# EAGLE schematic BIM_V2 (EAGLE 9.1.3)

## Sheet 1 of 7
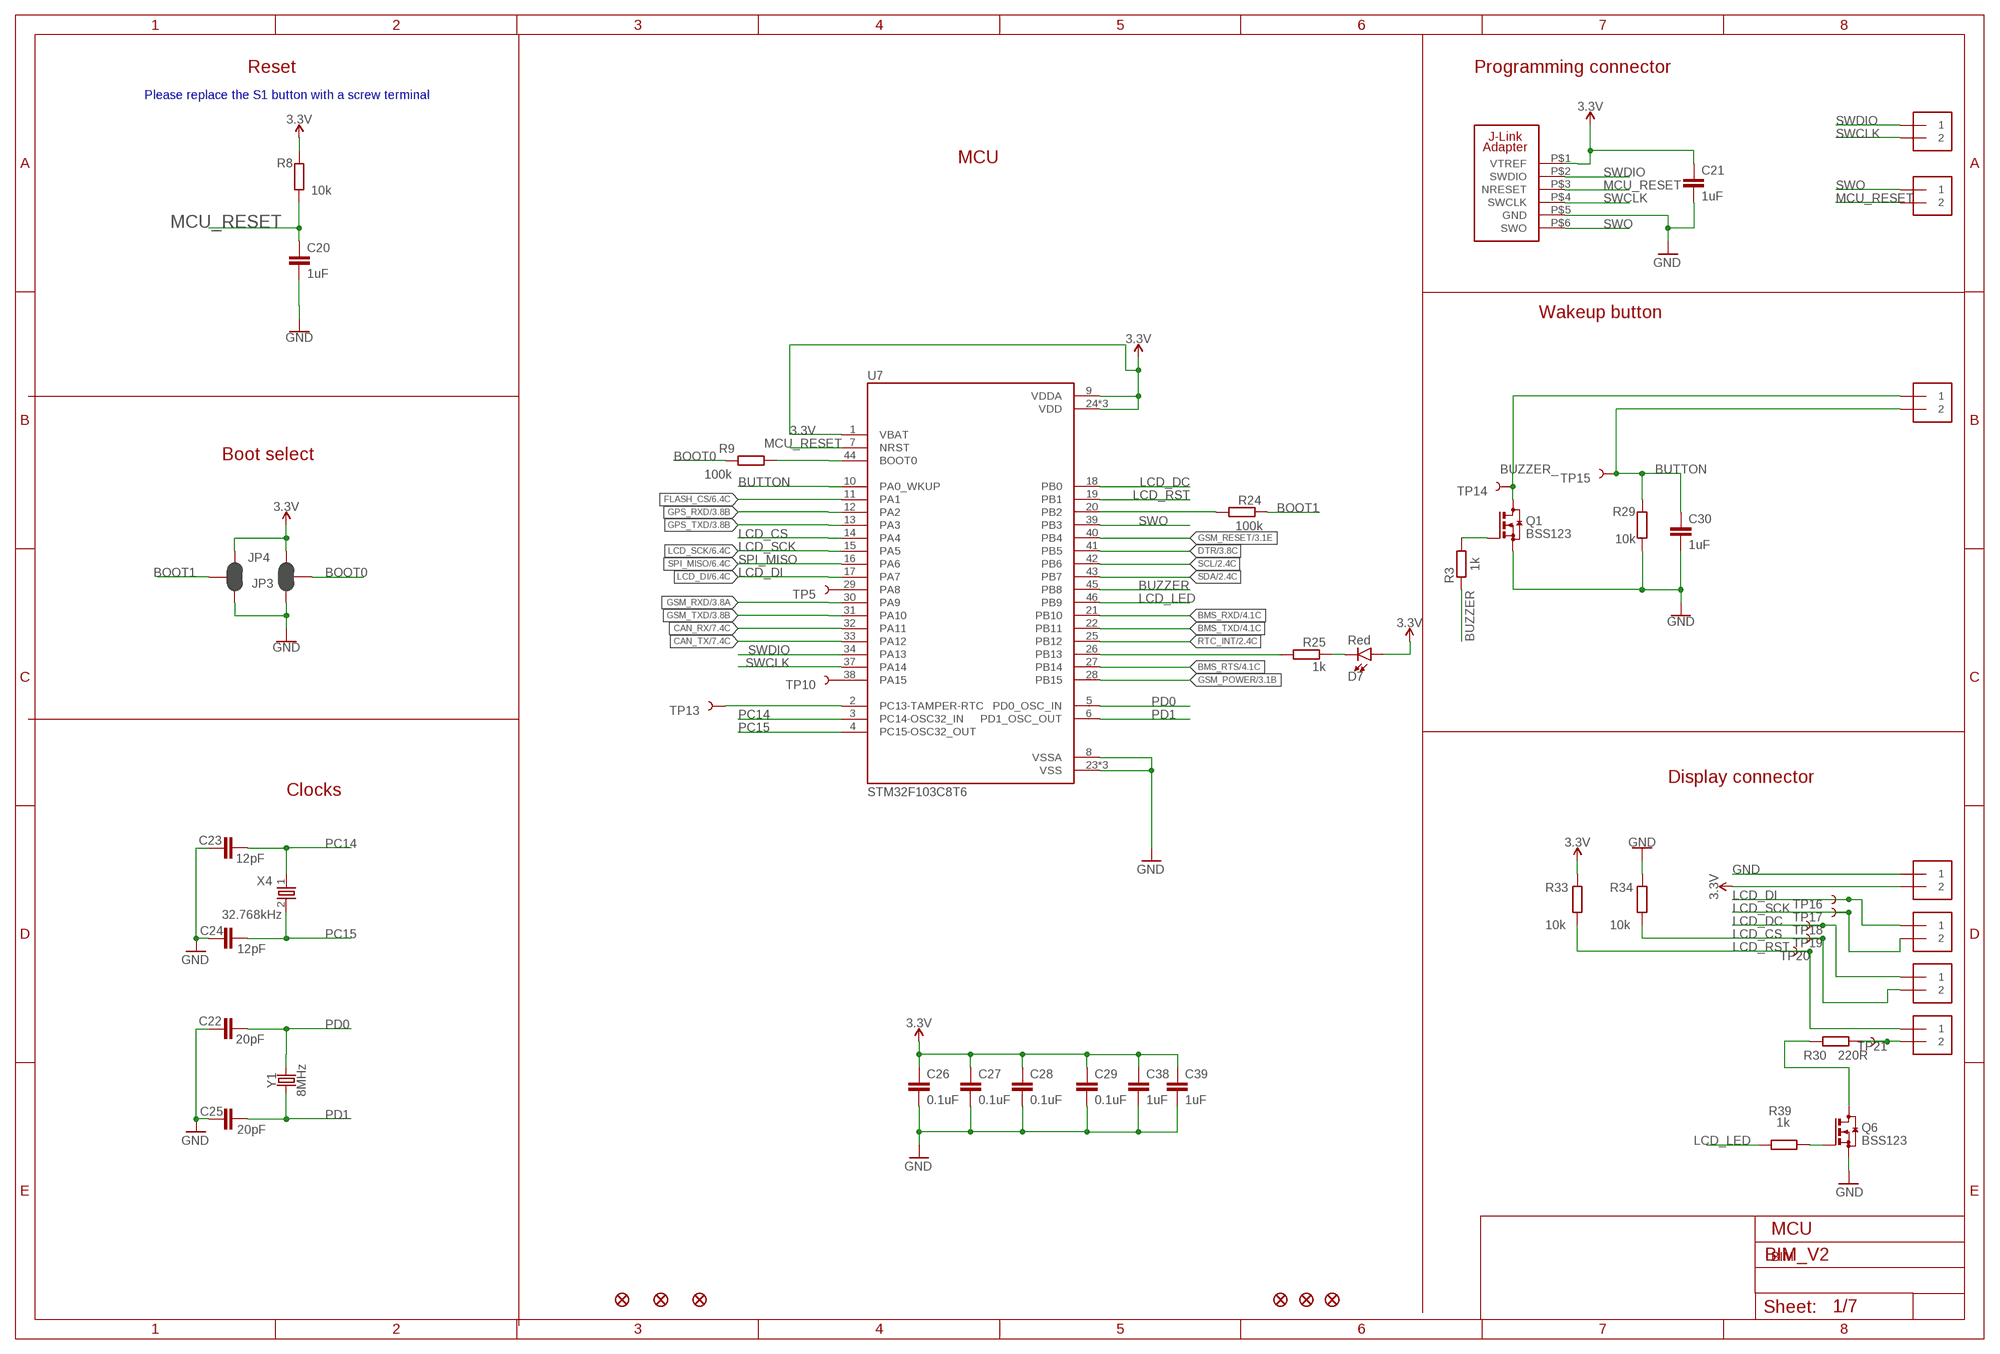
[diagram p0: schematic, sheet 1]

### Parts
C20  1uF  C-EUC0402  [C0402]
C21  1uF  C-EUC0402  [C0402]
C22  20pF  C-EUC0402  [C0402]
C23  12pF  C-EUC0402  [C0402]
C24  12pF  C-EUC0402  [C0402]
C25  20pF  C-EUC0402  [C0402]
C26  0.1uF  C-EUC0402  [C0402]
C27  0.1uF  C-EUC0402  [C0402]
C28  0.1uF  C-EUC0402  [C0402]
C29  0.1uF  C-EUC0402  [C0402]
C30  1uF  C-EUC0402  [C0402]
C38  1uF  C-EUC0402  [C0402]
C39  1uF  C-EUC0402  [C0402]
D7  Red  LED0603  [LED-0603]
FD1  FIDUCIAL1X2  [FIDUCIAL-1X2]
FD2  FIDUCIAL1X2  [FIDUCIAL-1X2]
FD3  FIDUCIAL1X2  [FIDUCIAL-1X2]
FD4  FIDUCIAL1X2  [FIDUCIAL-1X2]
FD5  FIDUCIAL1X2  [FIDUCIAL-1X2]
FD6  FIDUCIAL1X2  [FIDUCIAL-1X2]
JP3  JUMPER-SMT_3_2-NC_PASTE_SILK  [SMT-JUMPER_3_2-NC_PASTE_SILK]
JP4  JUMPER-SMT_3_2-NC_PASTE_SILK  [SMT-JUMPER_3_2-NC_PASTE_SILK]
Q1  BSS123  [SOT23]
Q6  BSS123  [SOT23]
R3  1k  R-EU_R0402  [R0402]
R8  10k  R-EU_R0402  [R0402]
R9  100k  R-EU_R0402  [R0402]
R24  100k  R-EU_R0402  [R0402]
R25  1k  R-EU_R0402  [R0402]
R29  10k  R-EU_R0402  [R0402]
R30  220R  R-EU_R0402  [R0402]
R33  10k  R-EU_R0402  [R0402]
R34  10k  R-EU_R0402  [R0402]
R39  1k  R-EU_R0402  [R0402]
S2  1X2-3.5MM  [1X2-3.5MM]
S3  1X2-3.5MM  [1X2-3.5MM]
S4  1X2-3.5MM  [1X2-3.5MM]
TP5  TEST-POINT3X4  [PAD.03X.04]
TP10  TEST-POINT3X4  [PAD.03X.04]
TP13  TEST-POINT3X4  [PAD.03X.04]
TP14  TEST-POINT3X4  [PAD.03X.04]
TP15  TEST-POINT3X4  [PAD.03X.04]
TP16  TEST-POINT3X4  [PAD.03X.04]
TP17  TEST-POINT3X4  [PAD.03X.04]
TP18  TEST-POINT3X4  [PAD.03X.04]
TP19  TEST-POINT3X4  [PAD.03X.04]
TP20  TEST-POINT3X4  [PAD.03X.04]
TP21  TEST-POINT3X4  [PAD.03X.04]
U7  STM32F103C8T6  [QFP50P900X900X160-48N]
U$1  J-LINK_6-PIN_ADAPTER-1  [J-LINK_6-PIN_ADAPTER_S]
X3-1  1X2-3.5MM  [1X2-3.5MM]
X3-2  1X2-3.5MM  [1X2-3.5MM]
X3-3  1X2-3.5MM  [1X2-3.5MM]
X3-4  1X2-3.5MM  [1X2-3.5MM]
X4  32.768kHz  XTAL_32KHZ  [XTAL_3215_N]
Y1  8MHz  CRYSTAL-8MHZSMD-5X3.2  [CRYSTAL-SMD-5X3.2-4PAD]

### Nets
3.3V: C21.1 C26.1 C27.1 C28.1 C29.1 C38.1 C39.1 D7.A JP3.3 JP4.3 R8.2 R33.1 U7.1(VBAT) U7.9(VDDA) U7.24(VDD) U7.36(VDD) U7.48(VDD) U$1.P$1(VTREF) X3-1.2 ; also sheet 2,3,4,5,6,7
BMS_RTS: U7.27(PB14) ; also sheet 4,7
BMS_RXD: U7.21(PB10) ; also sheet 4
BMS_TXD: U7.22(PB11) ; also sheet 4
BOOT0: JP3.2 R9.2
BOOT1: JP4.2 R24.2
BUTTON: C30.1 R29.2 S2.2 TP15.P$1 U7.10(PA0_WKUP)
BUZZER: R3.2 U7.45(PB8)
BUZZER_: Q1.3(D) S2.1 TP14.P$1
CAN_RX: U7.32(PA11) ; also sheet 7
CAN_TX: U7.33(PA12) ; also sheet 7
DTR: U7.41(PB5) ; also sheet 3
FLASH_CS: U7.11(PA1) ; also sheet 6
GND: C20.2 C21.2 C22.1 C23.1 C24.1 C25.1 C26.2 C27.2 C28.2 C29.2 C30.2 C38.2 C39.2 JP3.1 JP4.1 Q1.2(S) Q6.2(S) R29.1 R34.1 U7.8(VSSA) U7.23(VSS) U7.35(VSS) U7.47(VSS) U$1.P$5(GND) X3-1.1 ; also sheet 2,3,4,5,6,7
GPS_RXD: U7.12(PA2) ; also sheet 3
GPS_TXD: U7.13(PA3) ; also sheet 3
GSM_POWER: U7.28(PB15) ; also sheet 3
GSM_RESET: U7.40(PB4) ; also sheet 3
GSM_RXD: U7.30(PA9) ; also sheet 3
GSM_TXD: U7.31(PA10) ; also sheet 3
LCD_CS: R34.2 TP19.P$1 U7.14(PA4) X3-3.2
LCD_DC: TP18.P$1 U7.18(PB0) X3-3.1
LCD_DI: TP16.P$1 U7.17(PA7) X3-2.1 ; also sheet 6
LCD_LED: R39.2 U7.46(PB9)
LCD_RST: R33.2 TP20.P$1 U7.19(PB1) X3-4.1
LCD_SCK: TP17.P$1 U7.15(PA5) X3-2.2 ; also sheet 6
MCU_RESET: C20.1 R8.1 S4.2 U7.7(NRST) U$1.P$3(NRESET)
N$2: TP5.P$1 U7.29(PA8)
N$4: Q1.1(G) R3.1
N$7: TP13.P$1 U7.2(PC13-TAMPER-RTC)
N$8: TP10.P$1 U7.38(PA15)
N$9: D7.C R25.1
N$12: R25.2 U7.26(PB13)
N$19: R9.1 U7.44(BOOT0)
N$20: R24.1 U7.20(PB2)
N$23: Q6.3(D) R30.2
N$24: R30.1 TP21.P$1 X3-4.2
N$25: Q6.1(G) R39.1
PC14: C23.2 U7.3(PC14-OSC32_IN) X4.1
PC15: C24.2 U7.4(PC15-OSC32_OUT) X4.2
PD0: C22.2 U7.5(PD0_OSC_IN) Y1.3
PD1: C25.2 U7.6(PD1_OSC_OUT) Y1.1
RTC_INT: U7.25(PB12) ; also sheet 2
SCL: U7.42(PB6) ; also sheet 2
SDA: U7.43(PB7) ; also sheet 2
SPI_MISO: U7.16(PA6) ; also sheet 6
SWCLK: S3.2 U7.37(PA14) U$1.P$4(SWCLK)
SWDIO: S3.1 U7.34(PA13) U$1.P$2(SWDIO)
SWO: S4.1 U7.39(PB3) U$1.P$6(SWO)

### Notes on the sheet
- Reset | Programming connector
- Please replace the S1 button with a screw terminal
- MCU
- Wakeup button
- Boot select
- Display connector
- Clocks
- MCU
- BIM

## Sheet 2 of 7
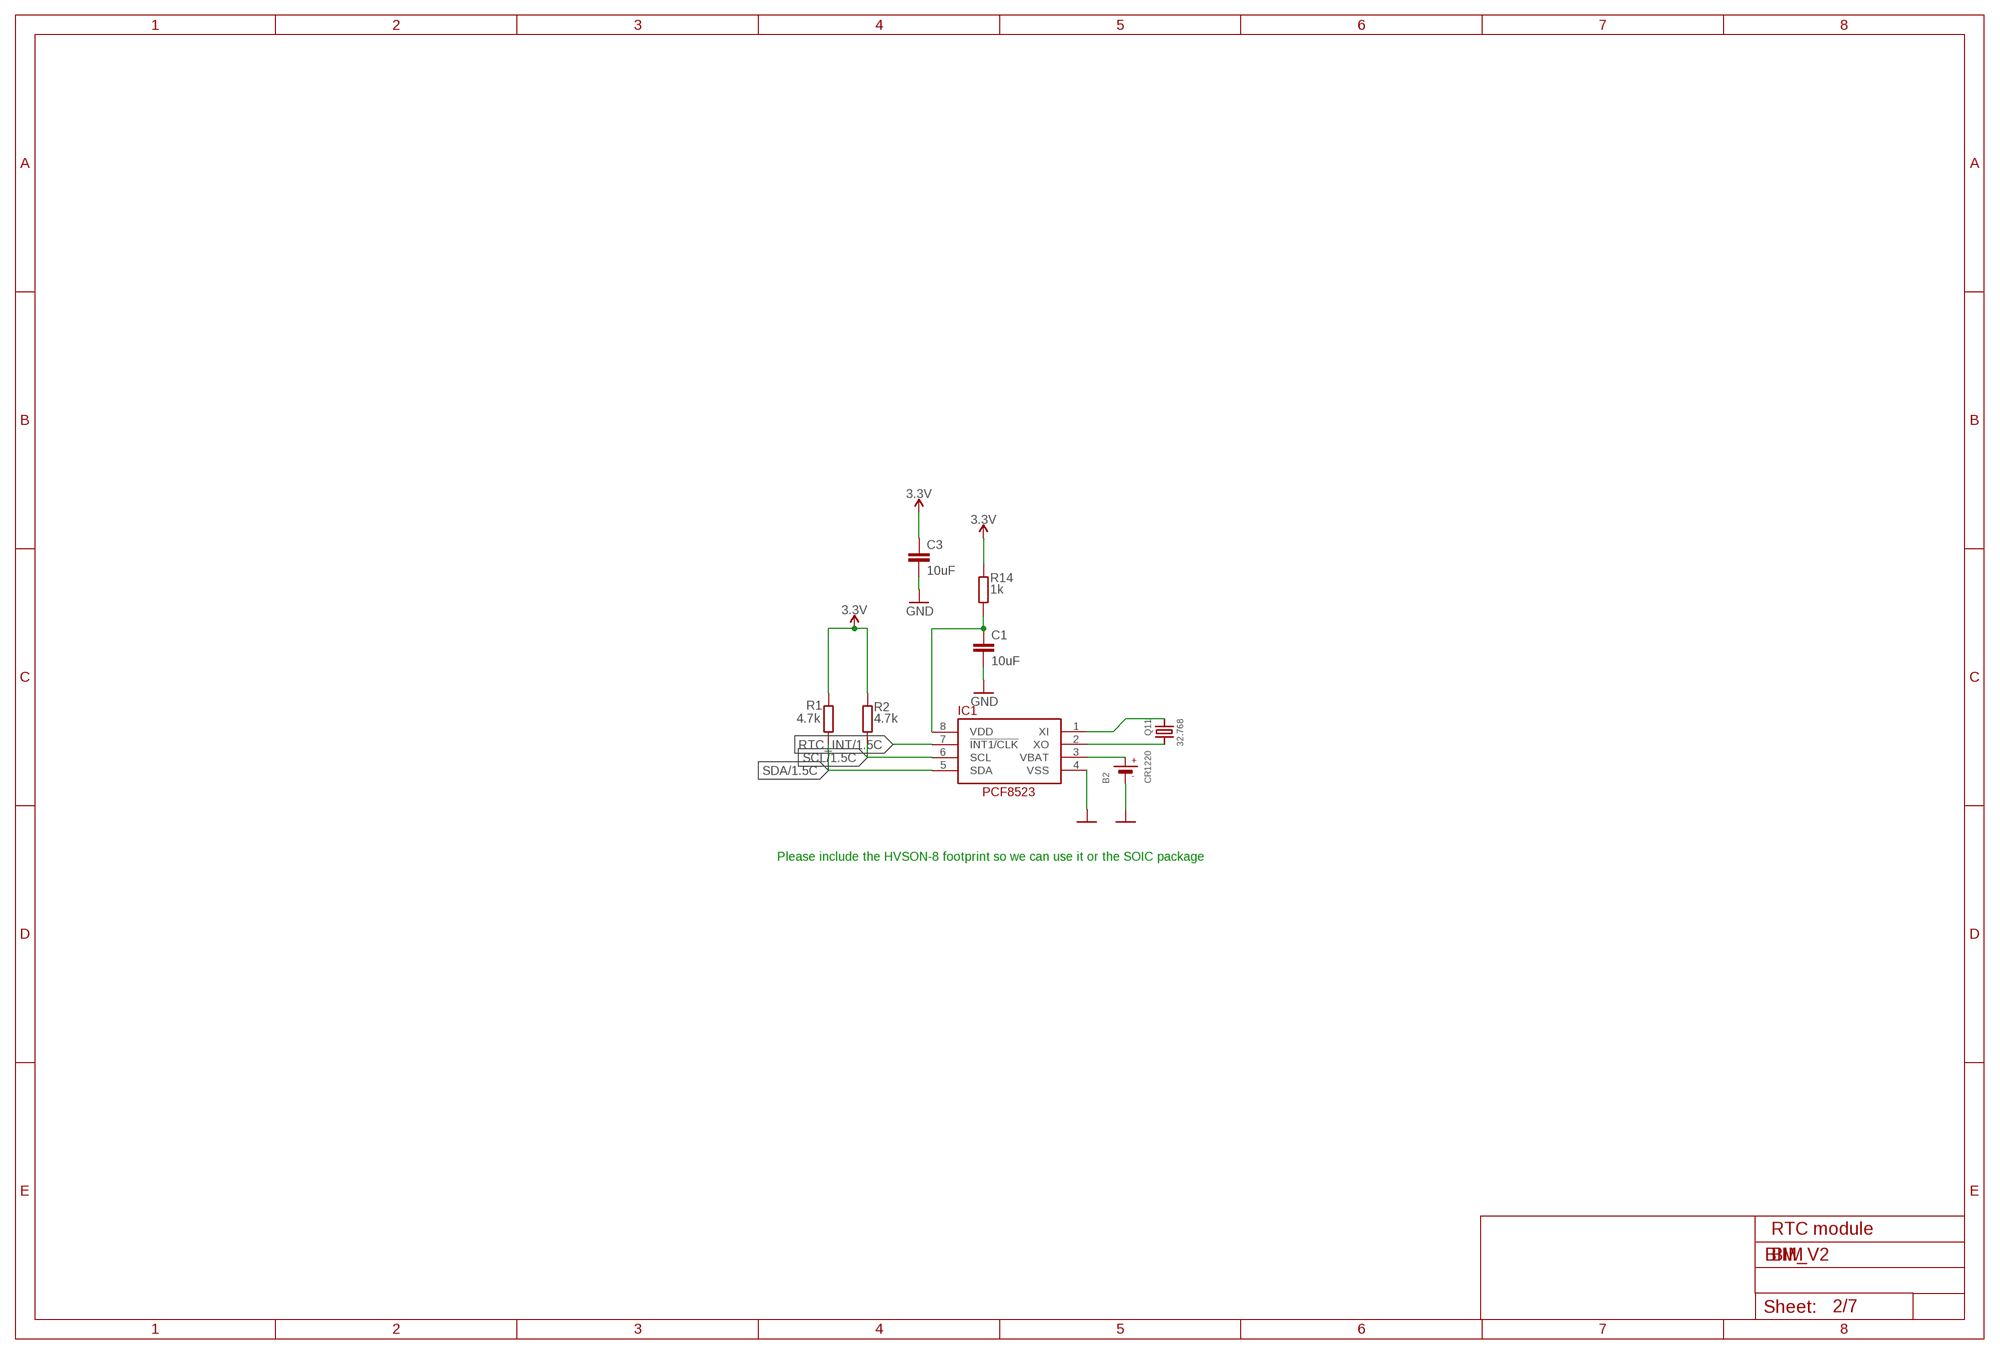
[diagram p1: schematic, sheet 2]

### Parts
B2  CR1220  BATTERYCR1220_SMT  [CR1220]
C1  10uF  C-EUC0402  [C0402]
C3  10uF  C-EUC0402  [C0402]
IC1  RTC_PCF8523T  [SOIC8_150MIL]
Q11  32.768  CRYSTAL8.0X3.8  [CRYSTAL_8X3.8]
R1  4.7k  R-EU_R0402  [R0402]
R2  4.7k  R-EU_R0402  [R0402]
R14  1k  R-EU_R0402  [R0402]

### Nets
3.3V: C3.1 R1.1 R2.1 R14.1 ; also sheet 1,3,4,5,6,7
GND: B2.- C1.2 C3.2 IC1.4(VSS) ; also sheet 1,3,4,5,6,7
N$6: IC1.1(XI) Q11.P$1
N$15: IC1.2(XO) Q11.P$4
N$17: C1.1 IC1.8(VDD) R14.2
RTC_INT: IC1.7(!INT1/CLK) ; also sheet 1
SCL: IC1.6(SCL) R2.2 ; also sheet 1
SDA: IC1.5(SDA) R1.2 ; also sheet 1
VBAT1: B2.+$1(+) IC1.3(VBAT)

### Notes on the sheet
- Please include the HVSON-8 footprint so we can use it or the SOIC package
- RTC module
- BIM

## Sheet 3 of 7
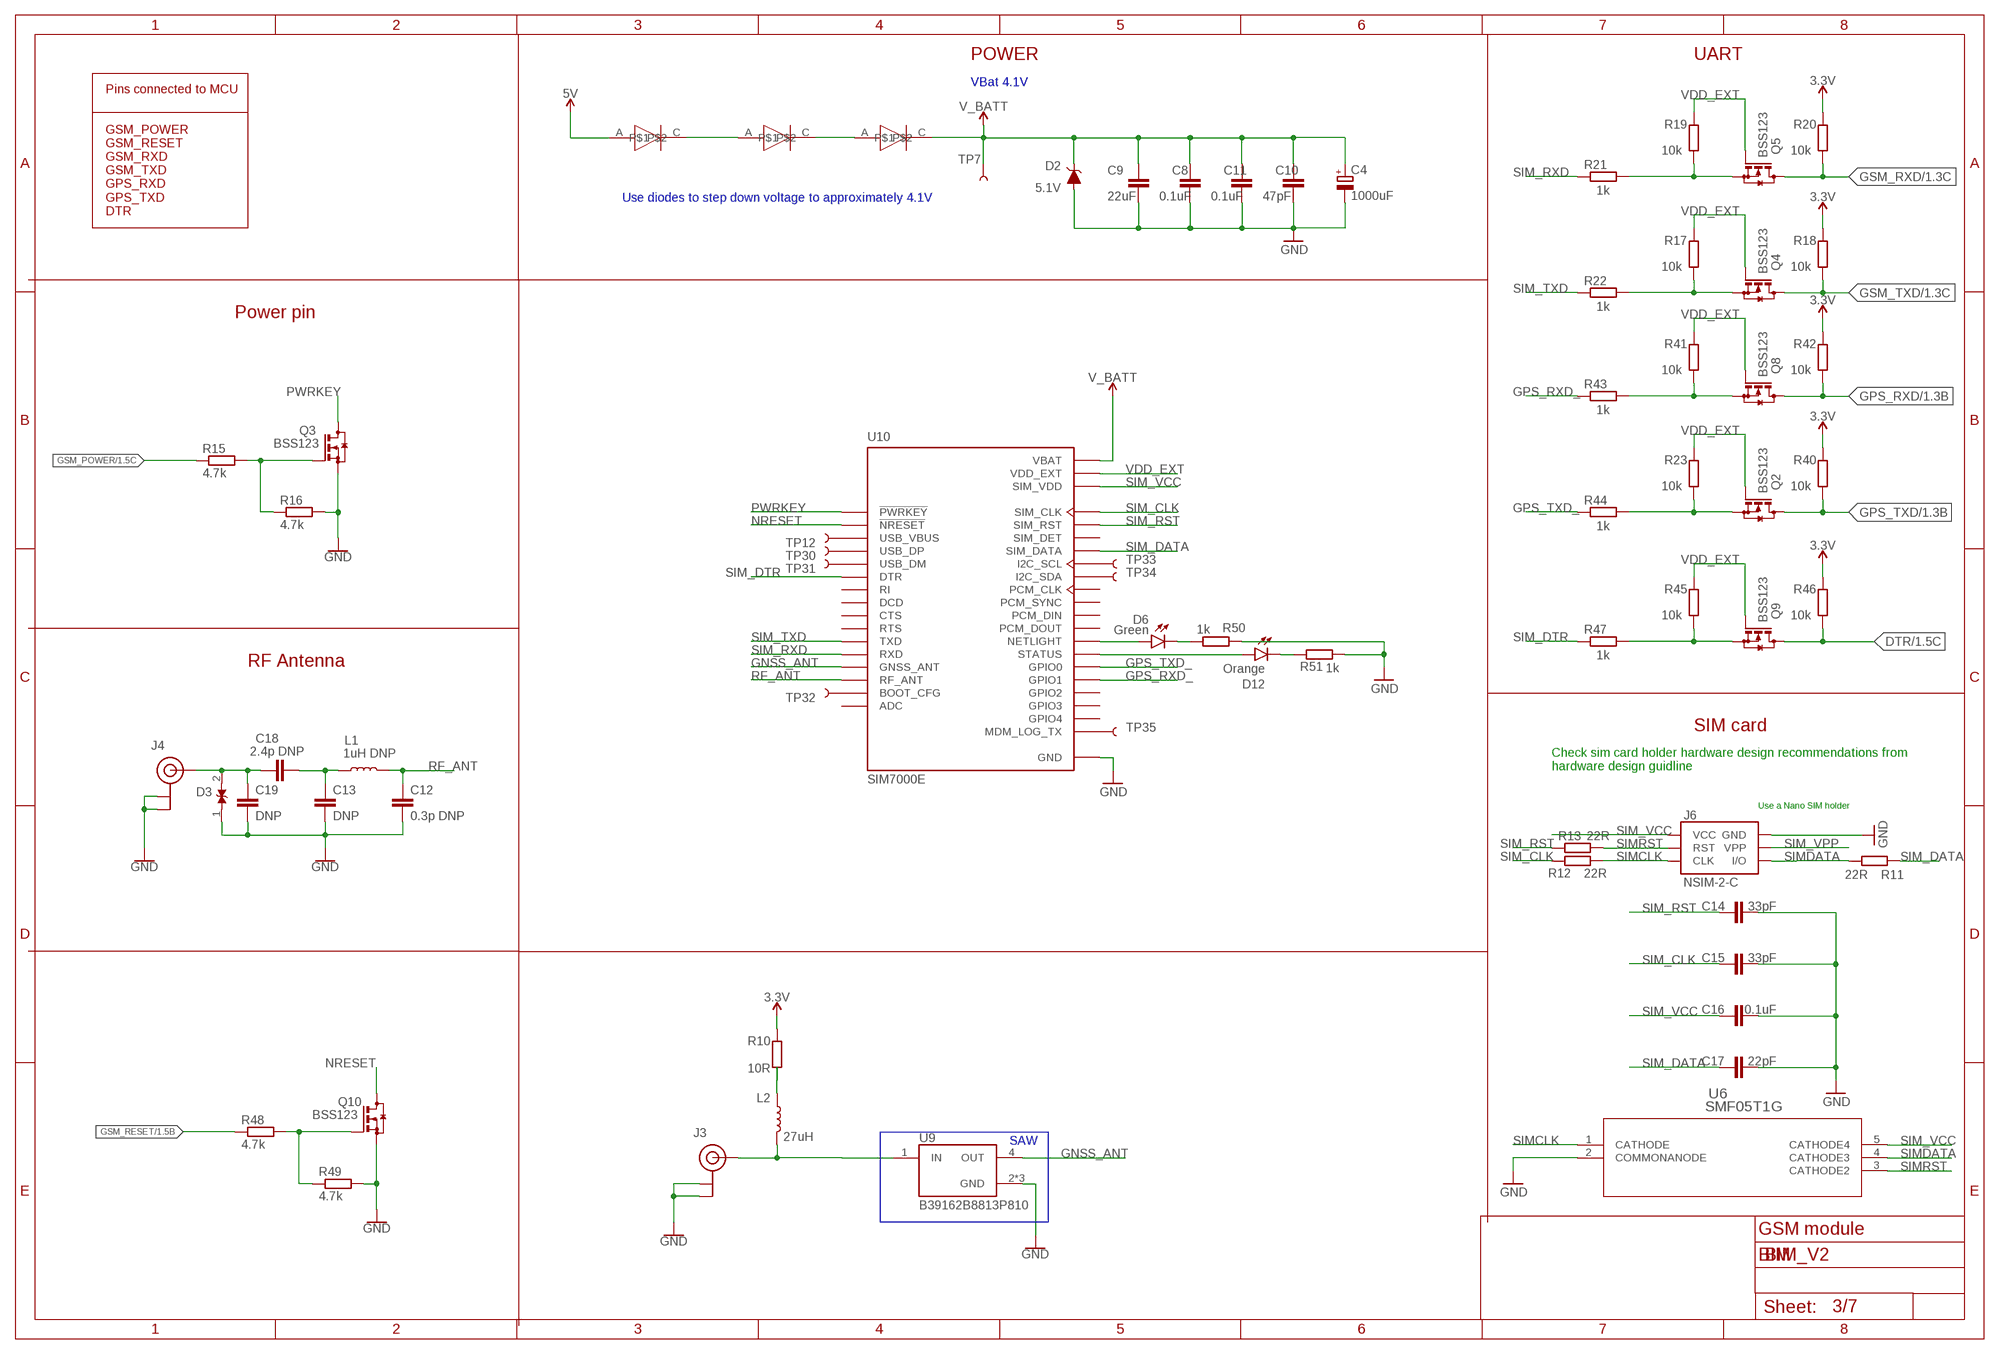
[diagram p2: schematic, sheet 3]

### Parts
C4  1000uF  CPOL-EUD/7343-31R  [D/7343-31R]
C8  0.1uF  C-EUC0402  [C0402]
C9  22uF  C-EUC0805  [C0805]
C10  47pF  C-EUC0402  [C0402]
C11  0.1uF  C-EUC0402  [C0402]
C12  0.3p DNP  C-EUC0402  [C0402]
C13  DNP  C-EUC0402  [C0402]
C14  33pF  C-EUC0402  [C0402]
C15  33pF  C-EUC0402  [C0402]
C16  0.1uF  C-EUC0402  [C0402]
C17  22pF  C-EUC0402  [C0402]
C18  2.4p DNP  C-EUC0402  [C0402]
C19  DNP  C-EUC0402  [C0402]
D2  5.1V  DIODE-ZENER-BZT52C3V6S  [SOD-323]
D3  D5V0L1B2LP4-7B  [DIODFN100X60X40-2N]
D6  Green  LED0603  [LED-0603]
D12  Orange  LED0603  [LED-0603]
J3  U.FL  [U.FL]
J4  U.FL  [U.FL]
J6  NSIM-2-C  SIMHOLDERSIM  [SIMHOLDER]
L1  1uH DNP  INDUCTOR-0603-33NH  [0603]
L2  27uH  INDUCTOR-0603-33NH  [0603]
Q2  BSS123  [SOT23]
Q3  BSS123  [SOT23]
Q4  BSS123  [SOT23]
Q5  BSS123  [SOT23]
Q8  BSS123  [SOT23]
Q9  BSS123  [SOT23]
Q10  BSS123  [SOT23]
R10  10R  R-EU_R0402  [R0402]
R11  22R  R-EU_R0402  [R0402]
R12  22R  R-EU_R0402  [R0402]
R13  22R  R-EU_R0402  [R0402]
R15  4.7k  R-EU_R0402  [R0402]
R16  4.7k  R-EU_R0402  [R0402]
R17  10k  R-EU_R0402  [R0402]
R18  10k  R-EU_R0402  [R0402]
R19  10k  R-EU_R0402  [R0402]
R20  10k  R-EU_R0402  [R0402]
R21  1k  R-EU_R0402  [R0402]
R22  1k  R-EU_R0402  [R0402]
R23  10k  R-EU_R0402  [R0402]
R40  10k  R-EU_R0402  [R0402]
R41  10k  R-EU_R0402  [R0402]
R42  10k  R-EU_R0402  [R0402]
R43  1k  R-EU_R0402  [R0402]
R44  1k  R-EU_R0402  [R0402]
R45  10k  R-EU_R0402  [R0402]
R46  10k  R-EU_R0402  [R0402]
R47  1k  R-EU_R0402  [R0402]
R48  4.7k  R-EU_R0402  [R0402]
R49  4.7k  R-EU_R0402  [R0402]
R50  1k  R-EU_R0402  [R0402]
R51  1k  R-EU_R0402  [R0402]
TP7  TEST-POINT3X4  [PAD.03X.04]
TP12  TEST-POINT3X4  [PAD.03X.04]
TP30  TEST-POINT3X4  [PAD.03X.04]
TP31  TEST-POINT3X4  [PAD.03X.04]
TP32  TEST-POINT3X4  [PAD.03X.04]
TP33  TEST-POINT3X4  [PAD.03X.04]
TP34  TEST-POINT3X4  [PAD.03X.04]
TP35  TEST-POINT3X4  [PAD.03X.04]
U6  SMF05T1G  [SC-88A-5_1P35X2P2_ONS]
U9  B39162B8813P810  [FIL_B39162B9417K610]
U10  SIM7000E  [SIMCON_SIM7000E]
U$2  0ohm 2010 resistor  HS3FB  [DIOM5436X261N]
U$3  0ohm 2010 resistor  HS3FB  [DIOM5436X261N]
U$4  HS3FB  [DIOM5436X261N]

### Nets
3.3V: R10.2 R18.2 R20.2 R40.2 R42.2 R46.2 ; also sheet 1,2,4,5,6,7
5V [INPUT]: U$2.A ; also sheet 5,7
DTR: Q9.3(D) R46.1 ; also sheet 1
GND: C4.- C8.2 C9.2 C10.2 C11.2 C12.2 C13.2 C14.2 C15.2 C16.2 C17.2 C19.2 D2.A D3.1 J3.1(GND) J3.2(GND) J4.1(GND) J4.2(GND) J6.C5(GND) Q3.2(S) Q10.2(S) R16.2 R49.2 R50.2 R51.2 U6.2(COMMONANODE) U9.2(GND) U9.3(GND) U9.5(GND) U10.2(GND) U10.17(GND) U10.18(GND) U10.29(GND) U10.39(GND) U10.45(GND) U10.46(GND) U10.54(GND) U10.58(GND) U10.59(GND) U10.61(GND) U10.62(GND) U10.63(GND) U10.64(GND) U10.65(GND) ; also sheet 1,2,4,5,6,7
GNSS_ANT: U9.4(OUT) U10.53(GNSS_ANT)
GPS_RXD: Q8.3(D) R42.1 ; also sheet 1
GPS_RXD_: R43.2 U10.49(GPIO1)
GPS_TXD: Q2.3(D) R40.1 ; also sheet 1
GPS_TXD_: R44.2 U10.50(GPIO0)
GSM_POWER: R15.1 ; also sheet 1
GSM_RESET: R48.1 ; also sheet 1
GSM_RXD: Q5.3(D) R20.1 ; also sheet 1
GSM_TXD: Q4.3(D) R18.1 ; also sheet 1
N$3: Q10.1(G) R48.2 R49.1
N$16: Q3.1(G) R15.2 R16.1
N$22: U$3.C U$4.A
N$30: U$2.C U$3.A
N$37: C13.1 C18.2 L1.1
N$38: J3.FEED(SIGNAL) L2.2 U9.1(IN)
N$39: TP33.P$1 U10.38(I2C_SCL)
N$40: L2.1 R10.1
N$41: TP12.P$1 U10.24(USB_VBUS)
N$42: TP30.P$1 U10.27(USB_DP)
N$43: TP31.P$1 U10.28(USB_DM)
N$44: TP34.P$1 U10.37(I2C_SDA)
N$45: D6.C R50.1
N$46: D6.A U10.52(NETLIGHT)
N$47: D12.C R51.1
N$48: D12.A U10.66(STATUS)
N$49: TP32.P$1 U10.6(BOOT_CFG)
N$50: TP35.P$1 U10.23(MDM_LOG_TX)
NRESET: Q10.3(D) U10.16(!NRESET)
PWRKEY: Q3.3(D) U10.1(!PWRKEY)
RF_ANT: C12.1 C18.1 C19.1 D3.2 J4.FEED(SIGNAL) L1.2 U10.60(RF_ANT)
SIM_CLK: C15.1 R12.1 U10.32(SIM_CLK)
SIM_DATA: C17.1 R11.1 U10.31(SIM_DATA)
SIM_DTR: R47.2 U10.3(DTR)
SIM_RST: C14.1 R13.1 U10.33(SIM_RST)
SIM_RXD: R21.2 U10.10(RXD)
SIM_TXD: R22.2 U10.9(TXD)
SIM_VCC: C16.1 J6.C1(VCC) U6.5(CATHODE4) U10.30(SIM_VDD)
SIM_VPP: J6.C6(VPP)
SIMCLK: J6.C3(CLK) R12.2 U6.1(CATHODE)
SIMDATA: J6.C7(I/O) R11.2 U6.4(CATHODE3)
SIMRST: J6.C2(RST) R13.2 U6.3(CATHODE2)
SIMRXD: Q5.2(S) R19.1 R21.1
SIMRXD1: Q8.2(S) R41.1 R43.1
SIMTXD: Q4.2(S) R17.1 R22.1
SIMTXD1: Q2.2(S) R23.1 R44.1
SIMTXD2: Q9.2(S) R45.1 R47.1
V_BATT: C4.+ C8.1 C9.1 C10.1 C11.1 D2.C TP7.P$1 U10.55(VBAT) U10.56(VBAT) U10.57(VBAT) U$4.C
VDD_EXT: Q2.1(G) Q4.1(G) Q5.1(G) Q8.1(G) Q9.1(G) R17.2 R19.2 R23.2 R41.2 R45.2 U10.15(VDD_EXT)
Unconnected: U10.4(RI) U10.5(DCD) U10.7(CTS) U10.8(RTS) U10.11(PCM_CLK) U10.12(PCM_SYNC) U10.13(PCM_DIN) U10.14(PCM_DOUT) U10.25(ADC) U10.34(SIM_DET) U10.48(GPIO4) U10.67(GPIO2) U10.68(GPIO3)

### Buses
B$2

### Notes on the sheet
- POWER | UART
- VBat 4.1V
- Pins connected to MCU
  
  
  GSM_POWER
  GSM_RESET
  GSM_RXD
  GSM_TXD
  GPS_RXD
  GPS_TXD
  DTR
- Use diodes to step down voltage to approximately 4.1V
- Power pin
- RF Antenna
- SIM card
- Check sim card holder hardware design recommendations from 
  hardware design guidline
- Use a Nano SIM holder
- SAW
- GSM module
- BIM

## Sheet 4 of 7
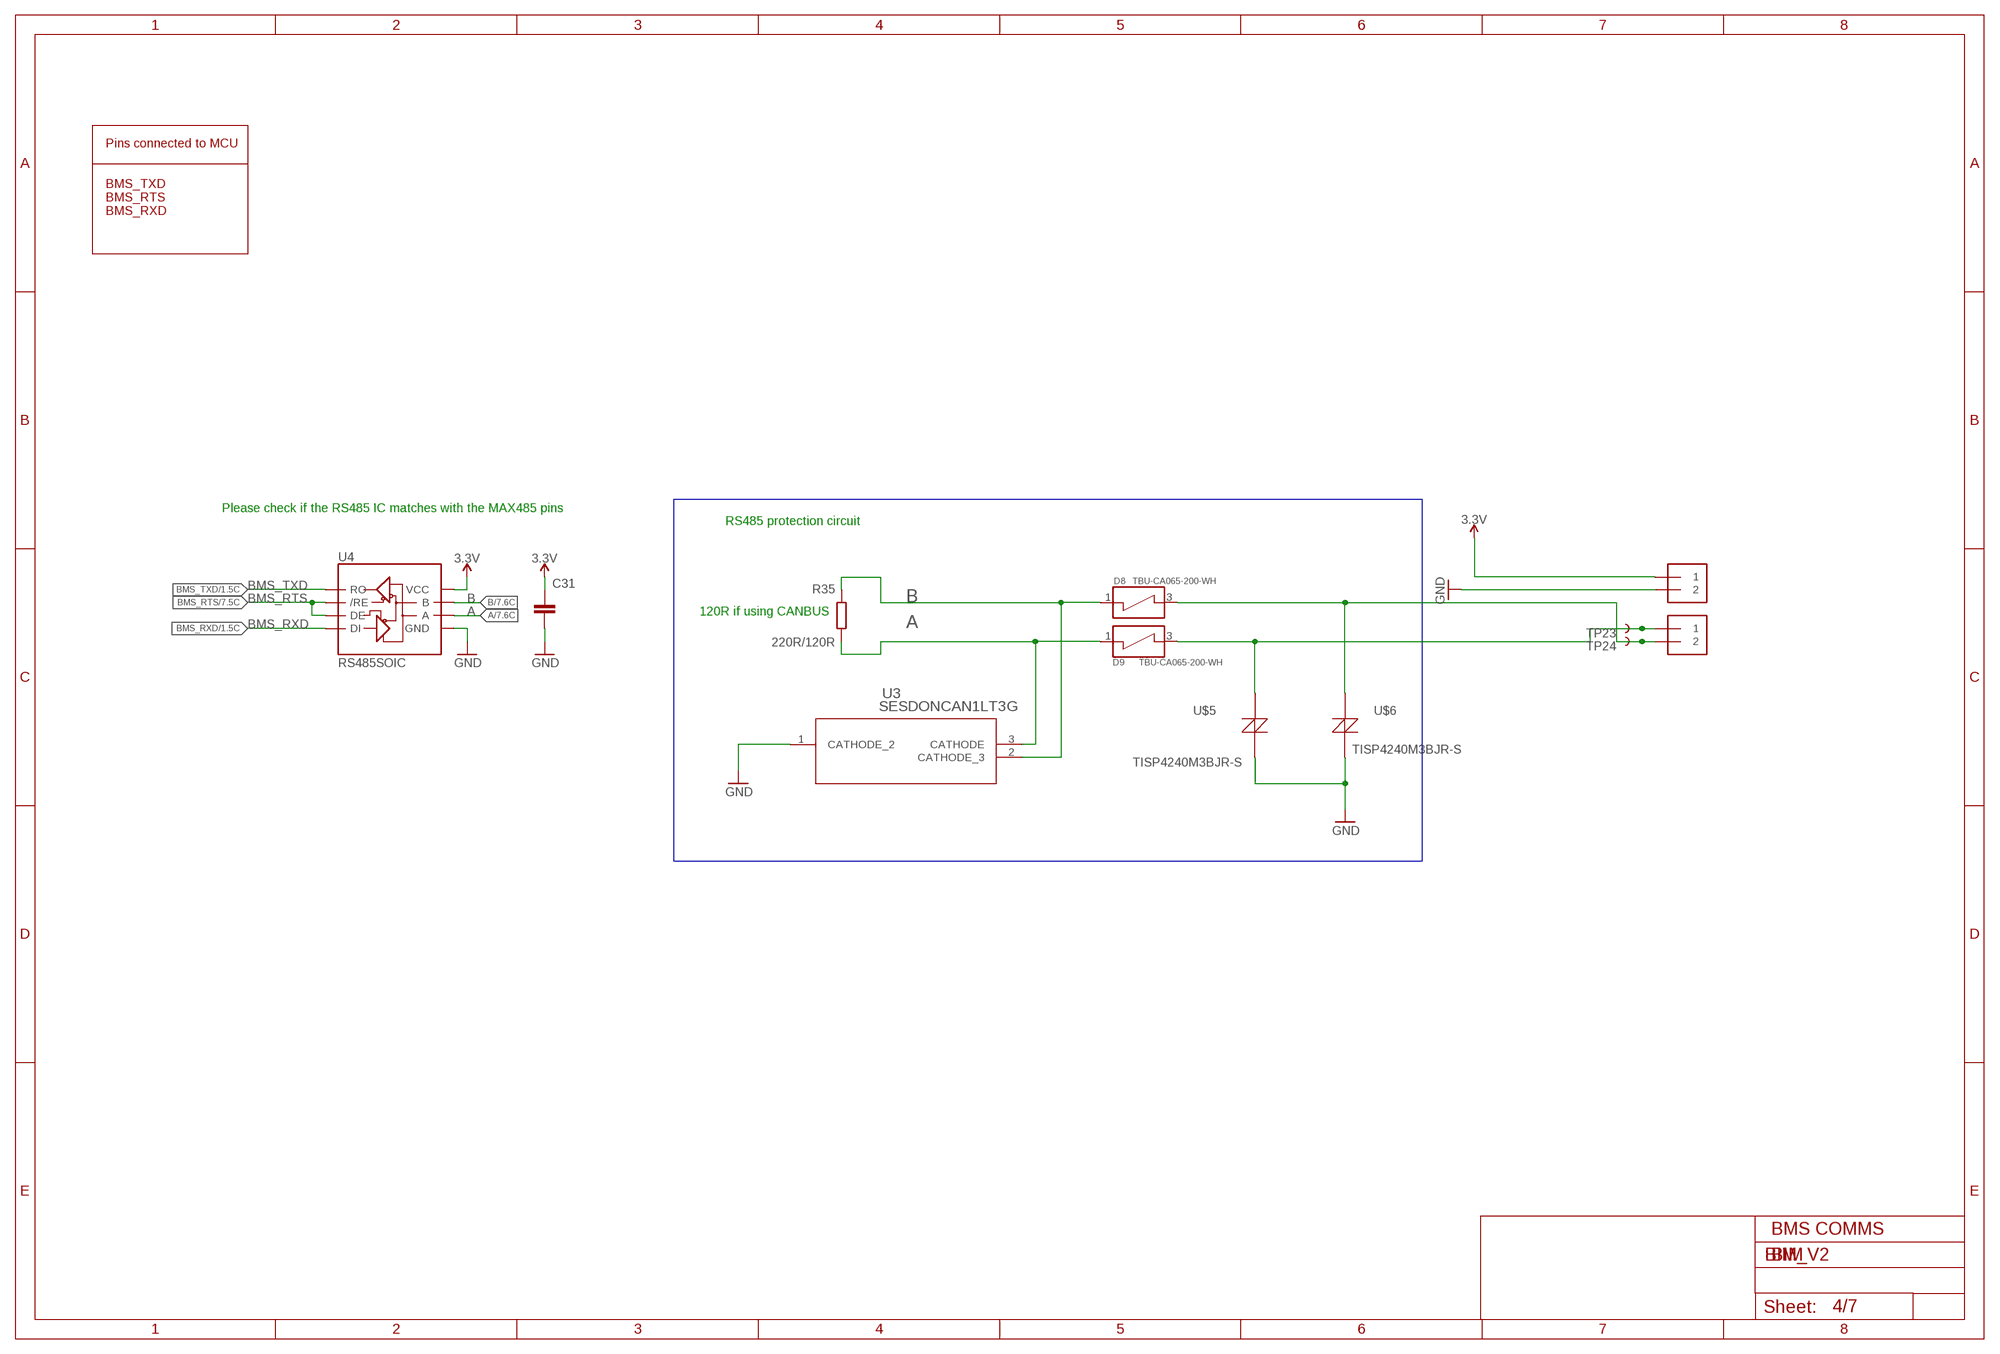
[diagram p3: schematic, sheet 4]

### Parts
C31  0.1uF  C-EUC0402  [C0402]
D8  TBU-CA065-200-WH  [DIOC650X400X100N]
D9  TBU-CA065-200-WH  [DIOC650X400X100N]
R35  220R/120R  R-EU_R0402  [R0402]
TP23  TEST-POINT3X4  [PAD.03X.04]
TP24  TEST-POINT3X4  [PAD.03X.04]
U3  SESDONCAN1LT3G  [SOT-23_ONS]
U4  RS485SOIC  [SO08]
U$5  TISP4240M3BJR-S  [DO-214AA]
U$6  TISP4240M3BJR-S  [DO-214AA]
X1-1  1X2-3.5MM  [1X2-3.5MM]
X1-2  1X2-3.5MM  [1X2-3.5MM]

### Nets
3.3V: C31.1 U4.8(VCC) X1-1.1 ; also sheet 1,2,3,5,6,7
A: D9.1 R35.1 U3.3(CATHODE) U4.6(A) ; also sheet 7
B: D8.1 R35.2 U3.2(CATHODE_3) U4.7(B) ; also sheet 7
BMS_RTS: U4.2(/RE) U4.3(DE) ; also sheet 1,7
BMS_RXD: U4.4(DI) ; also sheet 1
BMS_TXD: U4.1(RO) ; also sheet 1
GND: C31.2 U3.1(CATHODE_2) U4.5(GND) U$5.1 U$6.1 X1-1.2 ; also sheet 1,2,3,5,6,7
N$14: D9.3 TP23.P$1 U$5.2 X1-2.1
N$31: D8.3 TP24.P$1 U$6.2 X1-2.2

### Notes on the sheet
- Pins connected to MCU
  
  
  BMS_TXD
  BMS_RTS
  BMS_RXD
- Please check if the RS485 IC matches with the MAX485 pins
- RS485 protection circuit
- 120R if using CANBUS
- BMS COMMS
- BIM

## Sheet 5 of 7
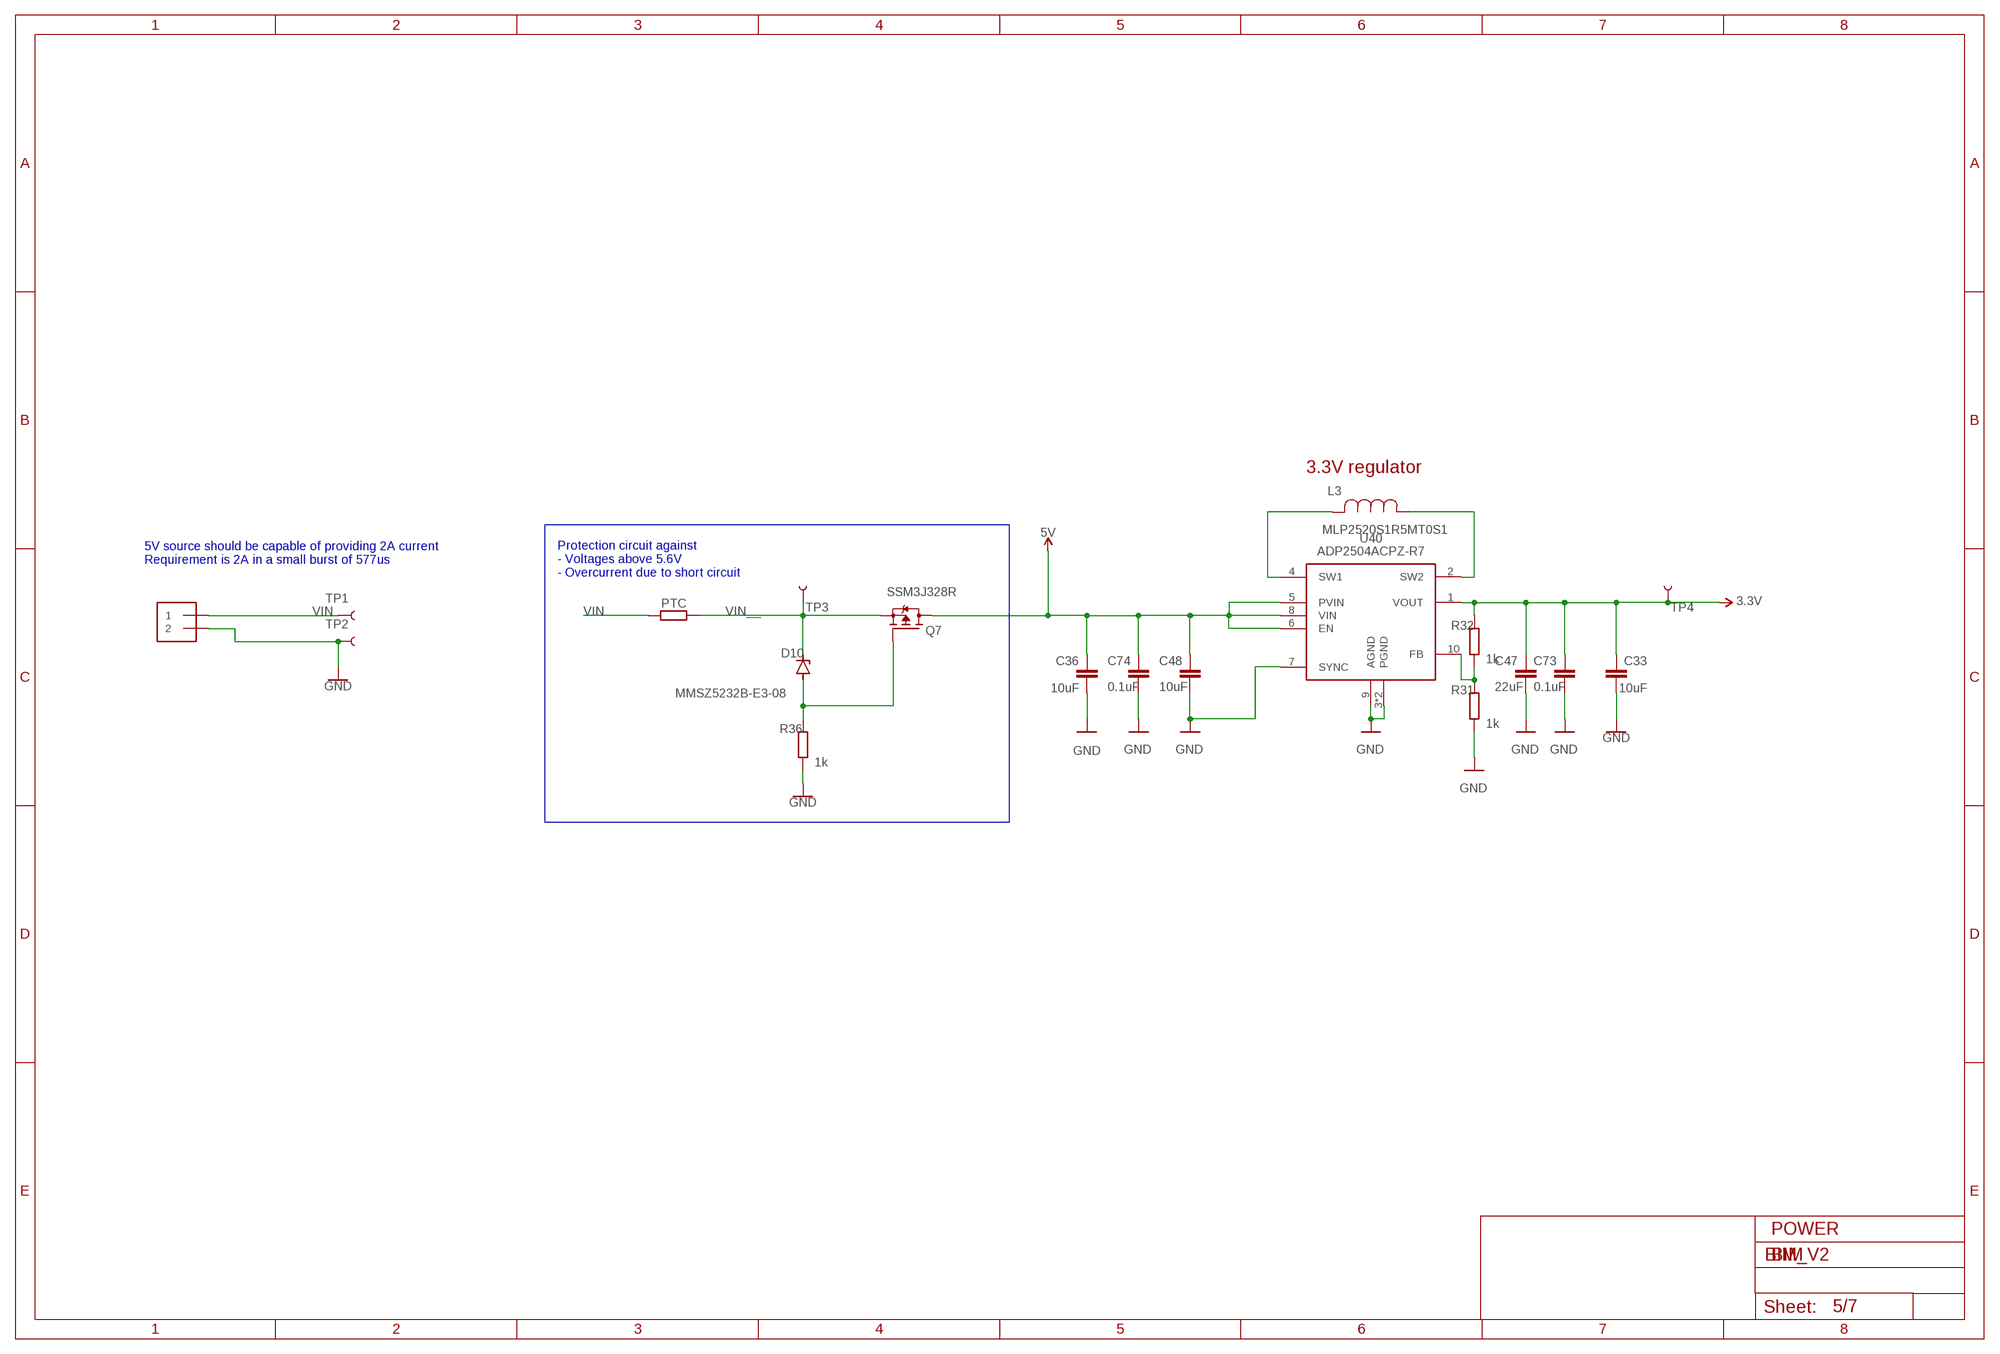
[diagram p4: schematic, sheet 5]

### Parts
C33  10uF  C-EUC0603  [C0603]
C36  10uF  C-EUC0603  [C0603]
C47  22uF  C-EUC0603  [C0603]
C48  10uF  C-EUC0402  [C0402]
C73  0.1uF  C-EUC0402  [C0402]
C74  0.1uF  C-EUC0402  [C0402]
D10  MMSZ5232B-E3-08  ZENER-DIODESOD80C  [SOD80C]
L3  MLP2520S1R5MT0S1  [IND_2520_TDK]
PTC  PRG18BC1R0MM1RB  R-EU_R0603  [R0603]
Q7  SSM3J328R  NTK3139PSOT-23F  [SOT-23F]
R31  1k  R-EU_R0402  [R0402]
R32  1k  R-EU_R0402  [R0402]
R36  1k  R-EU_R0402  [R0402]
TP1  TEST-POINT3X4  [PAD.03X.04]
TP2  TEST-POINT3X4  [PAD.03X.04]
TP3  TEST-POINT3X4  [PAD.03X.04]
TP4  TEST-POINT3X4  [PAD.03X.04]
U40  ADP2504ACPZ-R7  [SON50P300X300X80-11N]
X2  1X2-3.5MM  [1X2-3.5MM]

### Nets
3.3V: C33.1 C47.1 C73.1 R32.1 TP4.P$1 U40.1(VOUT) ; also sheet 1,2,3,4,6,7
5V [INPUT]: C36.1 C48.1 C74.1 Q7.3(D) U40.5(PVIN) U40.6(EN) U40.8(VIN) ; also sheet 3,7
GND: C33.2 C36.2 C47.2 C48.2 C73.2 C74.2 R31.2 R36.2 TP2.P$1 U40.3(PGND) U40.7(SYNC) U40.9(AGND) U40.11(PGND) X2.2 ; also sheet 1,2,3,4,6,7
N$11: R31.1 R32.2 U40.10(FB)
N$32: D10.A Q7.1(G) R36.1
N$152: L3.2 U40.4(SW1)
N$156: L3.1 U40.2(SW2)
VIN [INPUT]: PTC.2 TP1.P$1 X2.1
VIN__: D10.C PTC.1 Q7.2(S) TP3.P$1

### Notes on the sheet
- 3.3V regulator
- 5V source should be capable of providing 2A current 
  Requirement is 2A in a small burst of 577us
- Protection circuit against
  - Voltages above 5.6V
  - Overcurrent due to short circuit
- POWER
- BIM

## Sheet 6 of 7
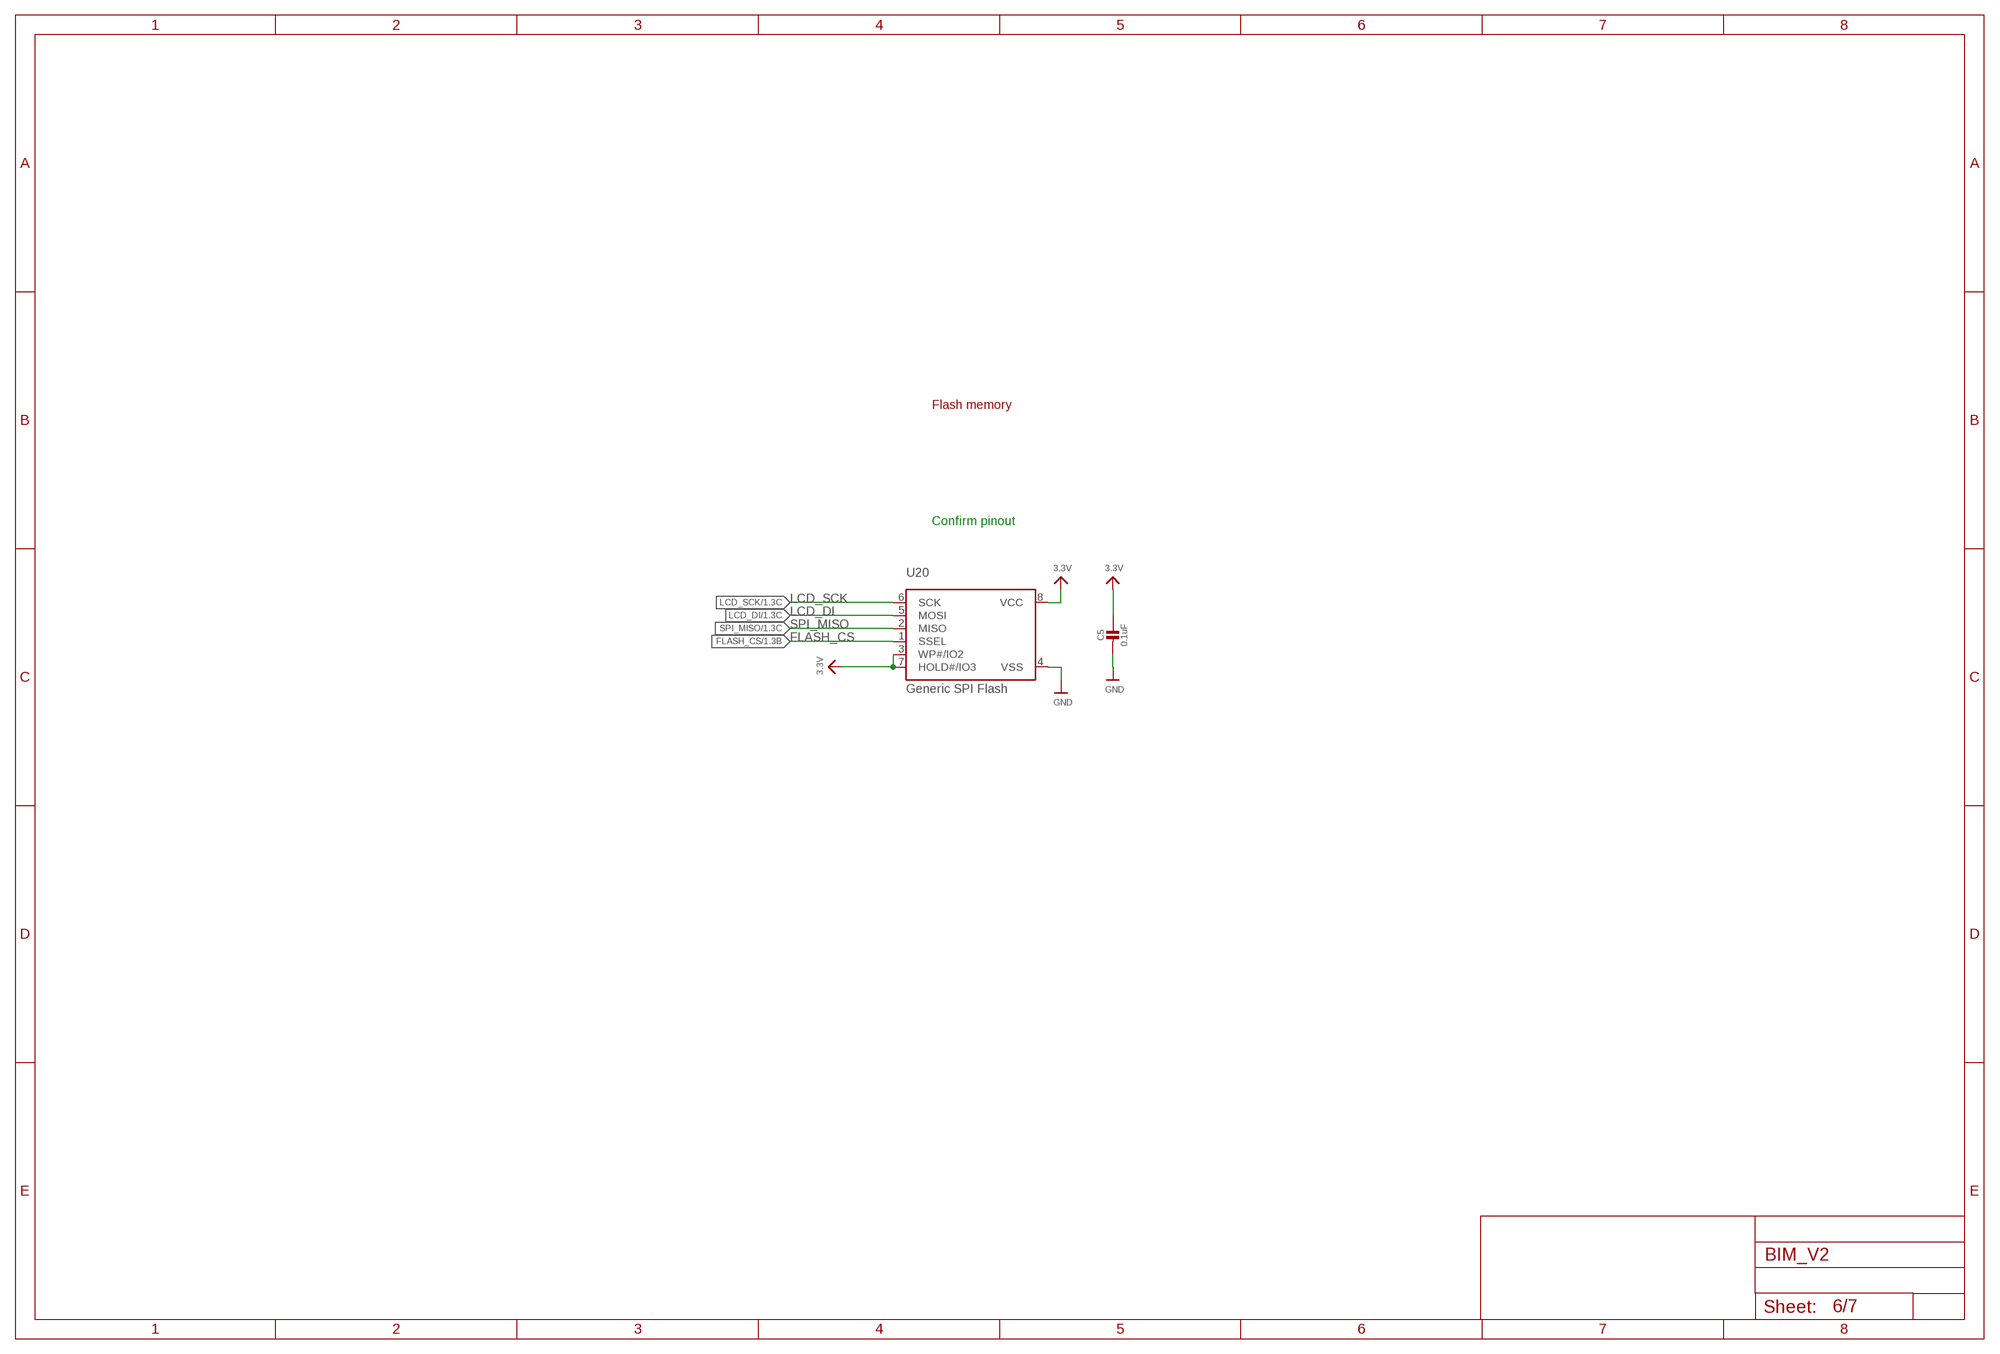
[diagram p5: schematic, sheet 6]

### Parts
C5  0.1uF  CAP_CERAMIC0603_NO  [0603-NO]
U20  Generic SPI Flash  SPIFLASH_8PIN208MIL  [SOIC8_208MIL]

### Nets
3.3V: C5.1 U20.3(WP#/IO2) U20.7(HOLD#/IO3) U20.8(VCC) ; also sheet 1,2,3,4,5,7
FLASH_CS: U20.1(SSEL) ; also sheet 1
GND: C5.2 U20.4(VSS) ; also sheet 1,2,3,4,5,7
LCD_DI: U20.5(MOSI) ; also sheet 1
LCD_SCK: U20.6(SCK) ; also sheet 1
SPI_MISO: U20.2(MISO) ; also sheet 1

### Notes on the sheet
- Flash memory
- Confirm pinout

## Sheet 7 of 7
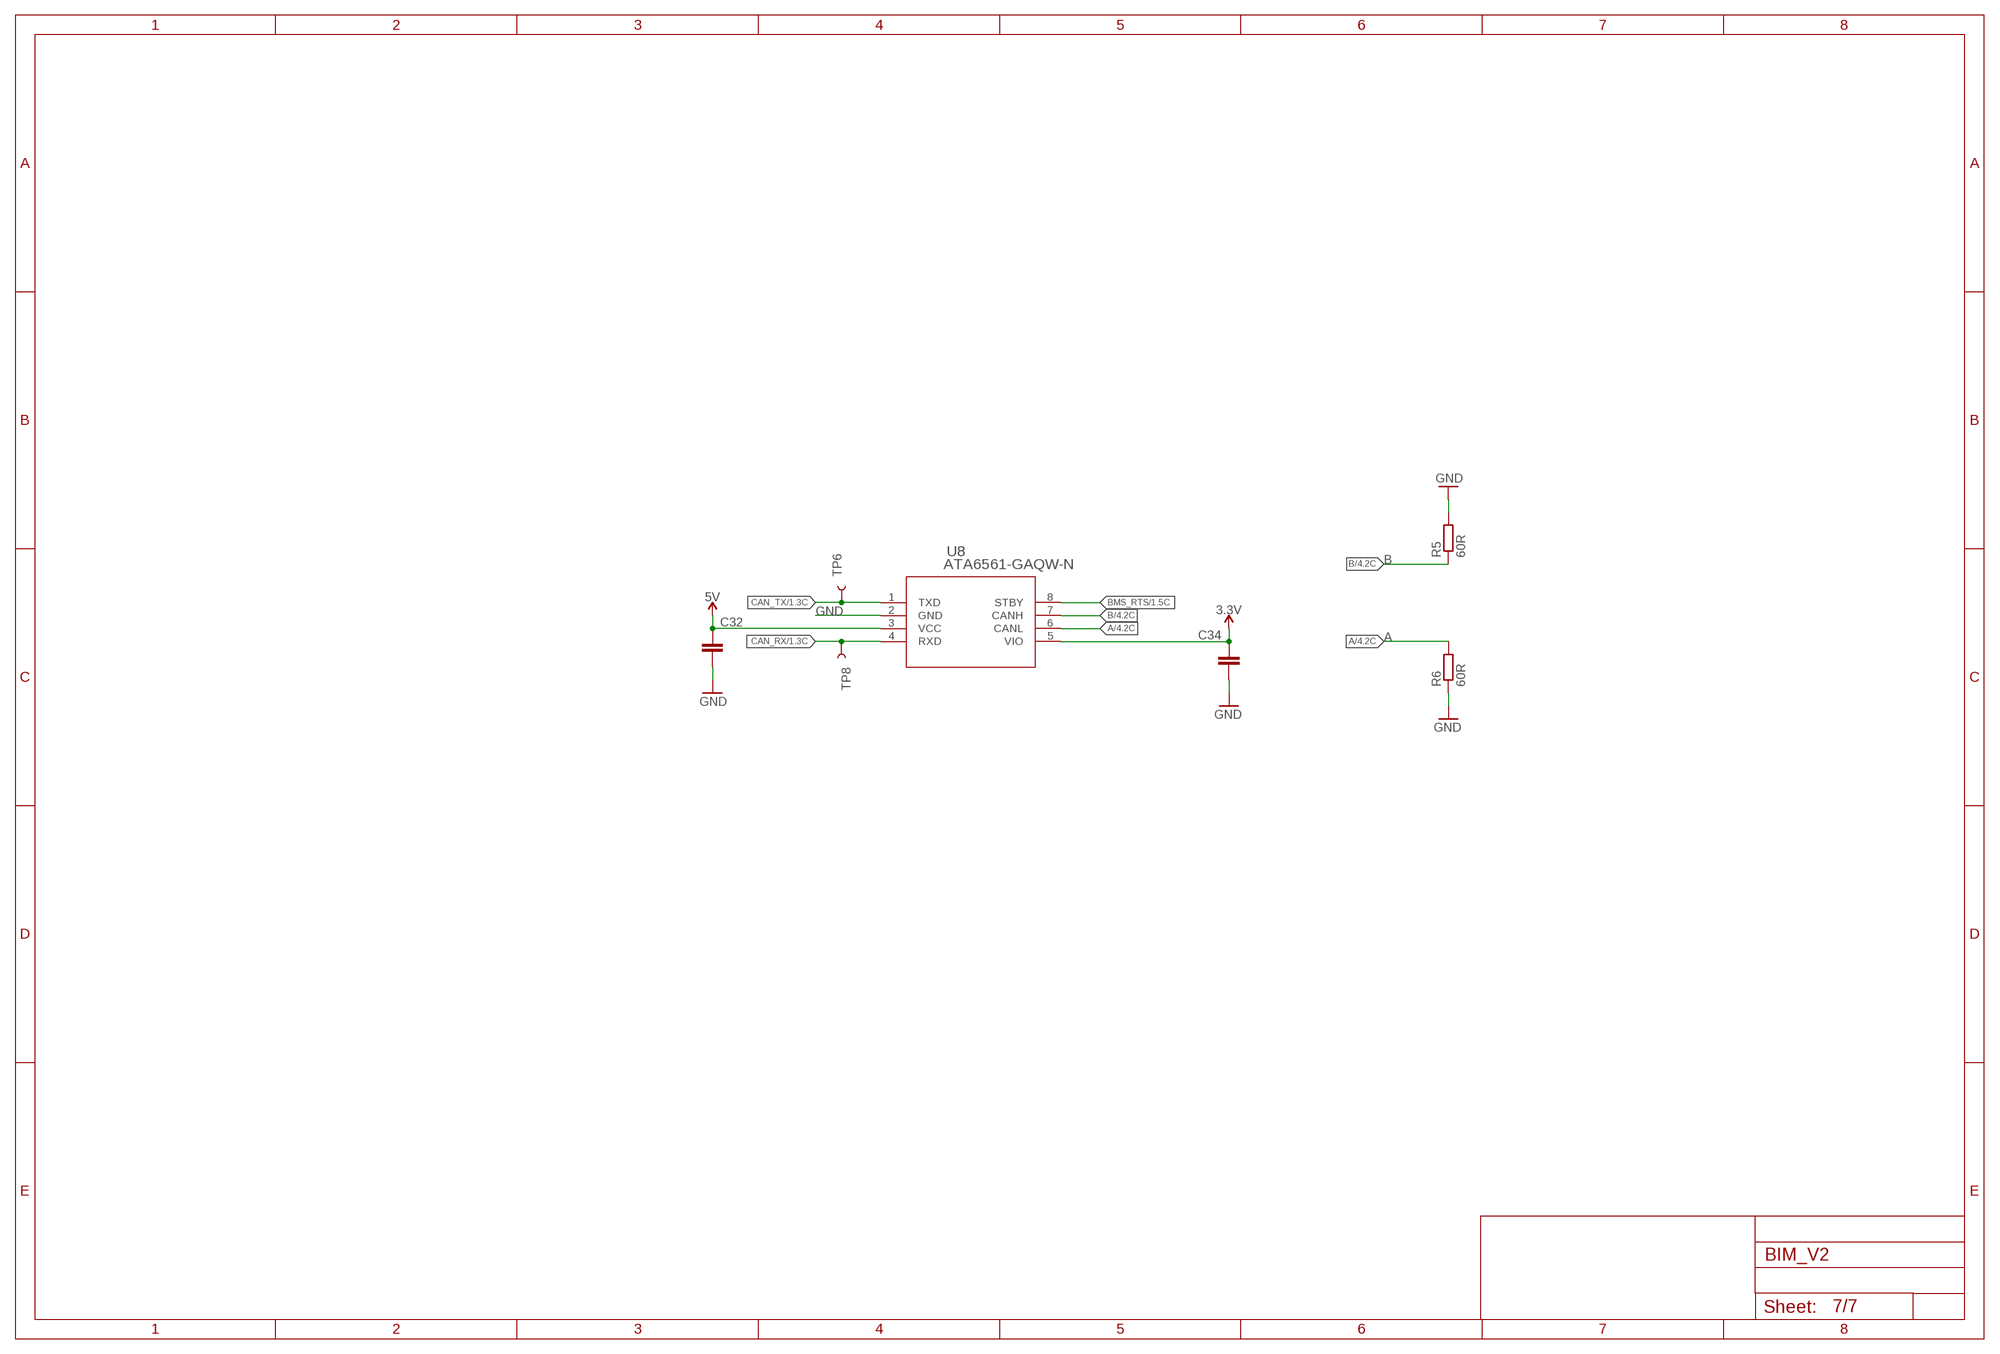
[diagram p6: schematic, sheet 7]

### Parts
C32  0.1uF  C-EUC0402  [C0402]
C34  0.1uF  C-EUC0402  [C0402]
R5  60R  R-EU_R0402  [R0402]
R6  60R  R-EU_R0402  [R0402]
TP6  TEST-POINT3X4  [PAD.03X.04]
TP8  TEST-POINT3X4  [PAD.03X.04]
U8  ATA6561-GAQW-N  [SOIC8_4P9X3P9MC_MCH]

### Nets
3.3V: C34.1 U8.5(VIO) ; also sheet 1,2,3,4,5,6
5V [INPUT]: C32.1 U8.3(VCC) ; also sheet 3,5
A: R6.2 U8.6(CANL) ; also sheet 4
B: R5.1 U8.7(CANH) ; also sheet 4
BMS_RTS: U8.8(STBY) ; also sheet 1,4
CAN_RX: U8.4(RXD) ; also sheet 1
CAN_TX: U8.1(TXD) ; also sheet 1
GND: C32.2 C34.2 R5.2 R6.1 U8.2(GND) ; also sheet 1,2,3,4,5,6
N$1: TP6.P$1
N$5: TP8.P$1

## Library data of the parts
B2 = microbuilder:BATTERY: CR1220 SMT - Digikey: 3001K-ND CD2032 BAT-HLD-001 - Digikey: BAT-HLD-001-ND
C1 C3 C8-C21 C26-C32 C34 C38 C39 C47 C48 C73 C74 = rcl:C-EU: CAPACITOR, European symbol; SPICEPREFIX: C
C4 = rcl:CPOL-EU: POLARIZED CAPACITOR, European symbol; SPICEPREFIX: C
C5 = microbuilder:CAP_CERAMIC: Ceramic Capacitors For new designs, use the packages preceded by an '_' character since they are more reliable: The following footprints should be used on most boards: _0402 - Standard footprint for regular board layouts _0603 - Standard footprint for regular board layouts _0805 - Standard footprint for regular board layouts _1206 - Standard footprint for regular board layouts For extremely tight-pitch boards where space is at a premium, the following 'micro-pitch' footprints can be used (smaller pads, no silkscreen outline, etc.): _0402MP - Micro-pitch footprint for very dense/compact boards _0603MP - Micro-pitch footprint for very dense/compact boards _0805MP - Micro-pitch footprint for very dense/compact boards _1206MP - Micro-pitch footprint for very dense/compact boards
C22-C25 C33 C36 = resistor:C-EU: CAPACITOR, European symbol
D2 = SparkFun-DiscreteSemi:DIODE-ZENER: Zener Diode A Zener diode allows current to flow from its anode to its cathode like a normal semiconductor diode, but it also permits current to flow in the reverse direction when its "Zener voltage" is reached. - WIkipedia; PROD_ID: DIO-08199; VALUE: 3.6V
D3 = D5V0L1B2LP4-7B:D5V0L1B2LP4-7B: 14V Clamp 6A (8/20µs) Ipp Tvs Diode Surface Mount X2-DFN1006-2; DESCRIPTION: 14V Clamp 6A (8/20µs) Ipp Tvs Diode Surface Mount X2-DFN1006-2; DIGI-KEY_PART_NUMBER: D5V0L1B2LP4-7BDICT-ND; MF: Diodes Inc.; MP: D5V0L1B2LP4-7B; PACKAGE: DFN-2 Diodes Inc.; PURCHASE-URL: https://pricing.snapeda.com/search/part/D5V0L1B2LP4-7B/?ref=eda
D6 D7 D12 = SparkFun-LED:LED: LED (Generic) Standard schematic elements and footprints for 5mm, 3mm, 1206, and 0603 sized LEDs. Generic LEDs with no color specified.
D8 D9 = TBU-CA065-200-WH:TBU-CA065-200-WH: TBU-CA065-200-WH, Bi-Directional TVS Diode, 12-Pin DFN; DESCRIPTION: SURGE SUPP TBU 200MA 650VIMP SMD; DIGI-KEY_PART_NUMBER: TBU-CA065-200-WHTR-ND; MF: Bourns; MP: TBU-CA065-200-WH; PACKAGE: SMD-4 Bourns; PURCHASE-URL: https://pricing.snapeda.com/search/part/TBU-CA065-200-WH/?ref=eda
D10 = diode:ZENER-DIODE: Z-Diode
FD1-FD6 = SparkFun-Aesthetics:FIDUCIAL: Fiducial Alignment Points Point-of-reference for pick-and-place machines and other optical instruments.
IC1 = microbuilder:RTC_PCF8523
J3 J4 = SparkFun-Connectors:U.FL: SMD Antenna Connector - U.FL 2mm height, 3.0mm x 3.0mm receptacle size. SparkFun Products: SparkFun WiFi Shield - ESP8266 <https://www.sparkfun.com/products/13287> SparkFun ESP8266 Thing <https://www.sparkfun.com/products/13231> SparkFun MiniGen - Pro Mini Signal Generator Shield <https://www.sparkfun.com/products/11420>; PROD_ID: CONN-09193; SF_ID: WRL-09144
J6 = SparkFun-Connectors:SIMHOLDER: SIM Cellular Card Socket SMT 6 pin standard connection. SparkFun Products: SIM Socket <https://www.sparkfun.com/products/548> SparkFun Cellular Shield - MG2639 <https://www.sparkfun.com/products/13120> SparkFun SIM Card Socket Breakout <https://www.sparkfun.com/products/573>; PROD_ID: CONN-08536; SF_ID: PRT-00548
JP3 JP4 = SparkFun-Jumpers:JUMPER-SMT_3_2-NC_PASTE: Normally closed solder jumper (2 of 2 connections) This jumper has an aperture in the stencil to allow solder paste to bridge both connections. Both connections are normally closed (NC). Wick off the solder to open the connection(s). Reapply solder to reclose the connection(s).
L1 L2 = SparkFun-Coils:INDUCTOR: Inductors Resist changes in electrical current. Basically a coil of wire. SparkFun Products: SparkFun Load Cell Amplifier - HX711 IOIO-OTG - V2.2; PROD_ID: NDUC-07874; VALUE: 33nH/±5%/500mA
L3 = MLP2520S1R5MT0S1:MLP2520S1R5MT0S1; COPYRIGHT: Copyright (C) 2022 Ultra Librarian. All rights reserved.; DIGI-KEY_PART_NUMBER_1: 445-6372-1-ND; DIGI-KEY_PART_NUMBER_2: 445-6372-2-ND; DIGI-KEY_PART_NUMBER_3: 445-6372-6-ND; MANUFACTURER_PART_NUMBER: MLP2520S1R5MT0S1; MFR_NAME: TDK
PTC R3 R5 R6 R10-R13 R15-R23 R25 R31-R36 R39-R51 = rcl:R-EU_: RESISTOR, European symbol; SPICEPREFIX: R
Q1-Q6 Q8-Q10 = transistor-small-signal:BSS123: N-CHANNEL MOS FET
Q7 = transistor-fet:NTK3139P: OptiMOS(R)-P Small-Signal-Transistor P-Channel, Enhancement mode, Super Logic Level (2.5 V rated) Source: http://www.infineon.com/upload/Document/BSA223SP_Rev1.3.pdf
Q11 = microbuilder:CRYSTAL: Crystals HC49UP - Surface Mount Crystal 4.0MHz 18pF +/-30ppm Surface Mount Crystal [Digikey: 535-9857-1-ND] 12.0 MHz Surface Mount Crystal [Digikey: 535-9869-6-ND] 25.0 MHz Surface Mount Crystal [Digikey: 535-9078-1-ND] 2.5 x 2.0mm - MEMs SMT Crystal 16.0 MHz 10pF 20ppm 2.5 x 2.0mm Crystal [Digikey -40-85°C: 535-10923-1-ND] 3.2 x 2.5mm - MEMs SMT Crystal 12.0 MHz 8pF 15ppm 3.2 x 2.5mm Crystal [Digikey: -10-70°C: 644-1047-1-ND -40-125°C: 644-1128-1-ND] 40~85°C cheaper: 644-1173-6-ND 16.0 MHz 8pF 15ppm 3.2 x 2.5mm Crystal [Digikey: -10-70°C: 644-1049-1-ND -40-125°C: 644-1129-2-ND]-40~85°C cheaper: 644-1175-6-ND 16.0 MHz 10pF 10ppm 3.2 x 2.5mm Crystal [Digikey: 644-1100-1-ND] 27.12 MHz 18pF 30ppm 3.2 x 2.5mm Crystal [Digikey: 887-1424-1-ND] 27.12MHz 10pF 10ppm 3.2 x 2.5mm Crystal [Digikey: 887-1329-1-ND] 4.9 x 1.8mm - MEMs SMT Crystal 32.768 KHz 12.5pF 20ppm 4.9 x 1.8mm Crystal [Digikey: SE2415CT-ND] 8.0 x 3.8mm - Surface Mount Crystal 32.768kHz 12.5pF 20ppm -40°C-85°C [Digikey: 535-9166-2-ND] Cylinder 32.768KHz Cylinder Crystal (2x6mm body) [Ex. Digikey: 300-8341-2-ND]
R1 R2 R8 R9 R14 R24 R29 R30 = resistor:R-EU_: RESISTOR, European symbol
S2-S4 X1-1 X1-2 X2 X3-1-X3-4 = adafruit:1X2: 3.5mm Terminal block http://www.ladyada.net/library/pcb/eaglelibrary.html
TP1-TP8 TP10 TP12-TP21 TP23 TP24 TP30-TP35 = SparkFun-Connectors:TEST-POINT: SparkFun Test Points Bare copper test points for troubleshooting or In-Circuit-Testing. These are used by our Production team for verifying production board runs using pogo-pins on test beds. SparkFun Products: SparkFun LSM9DS1 Breakout <https://www.sparkfun.com/products/13284> SparkFun PSOC <https://www.sparkfun.com/products/13714> SparkFun Load Cell Amplifier <https://www.sparkfun.com/products/13879>
U3 = SESDONCAN1LT3G:SESDONCAN1LT3G; COPYRIGHT: Copyright (C) 2021 Ultra Librarian. All rights reserved.; DIGI-KEY_PART_NUMBER_1: 488-SESDONCAN1LT3GTR-ND; DIGI-KEY_PART_NUMBER_2: 488-SESDONCAN1LT3GCT-ND; DIGI-KEY_PART_NUMBER_3: 488-SESDONCAN1LT3GDKR-ND; DIGI-KEY_PART_NUMBER_4: 2156-SESDONCAN1LT3G-OS-ND; MANUFACTURER_PART_NUMBER: SESDONCAN1LT3G; MFR_NAME: ON Semiconductor
U4 = SparkFun:RS485
U6 = SMF05T1G:SMF05T1G; COPYRIGHT: Copyright (C) 2021 Ultra Librarian. All rights reserved.; DIGI-KEY_PART_NUMBER_1: SMF05T1GOSTR-ND; DIGI-KEY_PART_NUMBER_2: SMF05T1GOSCT-ND; DIGI-KEY_PART_NUMBER_3: SMF05T1GOSDKR-ND; MANUFACTURER_PART_NUMBER: SMF05T1G; MFR_NAME: ON Semiconductor
U7 = STM32F103C8T6:STM32F103C8T6: Mainstream Performance line, ARM Cortex-M3 MCU with 64 Kbytes Flash, 72 MHz CPU, motor control, USB and CAN Check prices; AVAILABILITY: In Stock; DESCRIPTION: ARM® Cortex®-M3 STM32F1 Microcontroller IC 32-Bit 72MHz 64KB (64K x 8) FLASH 48-LQFP (7x7); MF: STMicroelectronics; MP: STM32F103C8T6; PACKAGE: LQFP-48 STMicroelectronics; PRICE: None; PURCHASE-URL: https://pricing.snapeda.com/search/part/STM32F103C8T6/?ref=eda
U8 = ATA6561_GAQW:ATA6561-GAQW-N; COPYRIGHT: Copyright (C) 2023 Ultra Librarian. All rights reserved.; MANUFACTURER_PART_NUMBER: ATA6561-GAQW-N; MFR_NAME: Microchip
U9 = B39162:B39162B8813P810: SAW Filter 1582.47MHz 50Ohm SMD 5-Pin SMD; DESCRIPTION: Frequency RF SAW Filter (Surface Acoustic Wave) Bandwidth 5-SMD, No Lead; DIGI-KEY_PART_NUMBER: 495-7022-1-ND; MF: Qualcomm (RF360; MP: B39162B8813P810; PACKAGE: SMD-5 Qualcomm (RF360; PURCHASE-URL: https://pricing.snapeda.com/search/part/B39162B8813P810/?ref=eda
U10 = SIM7000E:SIM7000E: Multi-Band LTE-FDD and Dual-Band GSM/GPRS/EDGE module solution in a SMT type which supports LTE eMTC(CAT-M1) and NB-IoT up to 375kbps for downlink data transfer. Check availability; AVAILABILITY: In Stock; CHECK_PRICES: https://www.snapeda.com/parts/SIM7000E/SIMcom+Wireless+solutions+Co.%252CLtd/view-part/?ref=eda; DESCRIPTION: 802.15.4 Cat-M, Cat-NB, EDGE, GPRS, LPWA Transceiver Module 900MHz, 1.8GHz Antenna Not Included Surface Mount; MF: SIMCom; MP: SIM7000E; PACKAGE: None; PRICE: None; PURCHASE-URL: https://www.snapeda.com/api/url_track_click_mouser/?unipart_id=11942027&manufacturer=SIMCom&part_name=SIM7000E&search_term=sim7000; SNAPEDA_LINK: https://www.snapeda.com/parts/SIM7000E/SIMcom+Wireless+solutions+Co.%252CLtd/view-part/?ref=snap
U20 = microbuilder:SPIFLASH_8PIN: SOIC8 SPI Flash Be careful with the size since SOIC8 flash comes in several 'widths' SOIC8 150 mil M25P16 - 16Mbit (2Mbit x 8) Serial Flash (75MHz SPI Bus), Supply: 2.7-3.6V Digikey: SOIC8 - M25P16-VMN6P-ND SOIC8 208 mil W25Q16BVSSIG - 16Mbit (2Mbit x 8) Serial Flash (104MHz SPI Bus), Supply: 2.7-3.6V Digikey: SOIC8 - W25Q16BVSSIG-ND
U40 = ADP2504ACPZ-R7:ADP2504ACPZ-R7: DC-DC Adj. 1A 2.5MHz Buck-Boost LFCSP10 Analog Devices ADP2504ACPZ-R7, PWM Current Mode Controller, 1 A, 2500 kHz, 2.3 5.5 V, 10-Pin LFCSP WD Source: Datasheet Check availability; AVAILABILITY: In Stock; DESCRIPTION: Buck-Boost Switching Regulator IC Positive Adjustable 2.8V 1 Output 1A 10-VFDFN Exposed Pad, CSP; MF: Analog Devices; MP: ADP2504ACPZ-R7; PACKAGE: LFCSP -10 Analog Devices; PRICE: None; PURCHASE-URL: https://pricing.snapeda.com/search/part/ADP2504ACPZ-R7/?ref=eda
U$1 = debug-connectors:J-LINK_6-PIN_ADAPTER: J-Link 6-pin Adapter See https://www.segger.com/jlink-6-pin-adapter.html
U$2-U$4 = HS3FB:HS3FB
U$5 U$6 = TISP4240M3BJR-S:TISP4240M3BJR-S
X4 = Nordic_nRF:XTAL_32KHZ
Y1 = SparkFun-Clocks:CRYSTAL-8MHZ: 8MHz Crystal Datasheet Example <http://www.futureelectronics.com/en/technologies/electromechanical/timing-devices/crystals/Pages/6008189-ABM3B-8.000MHZ-B2-T.aspx?IM=0> Frequency: 8MHz Frequency Tolerance: ±20ppm Load Capacitance: 18pF SparkFun Products: Pro Micro -3.3V/8MHz <https://www.sparkfun.com/products/12587> WAV Trigger <https://www.sparkfun.com/products/13660>; PROD_ID: XTAL-09431

## Net classes
1 power: width 0.254 mm, drill 0.2 mm
2 signal: width 0.203 mm, drill 0.2 mm
3 INPUT: width 0.203 mm, drill 0.005 mm